# EAGLE design SparkX_EZ_ARTIC_R2 (EAGLE 9.6.2)
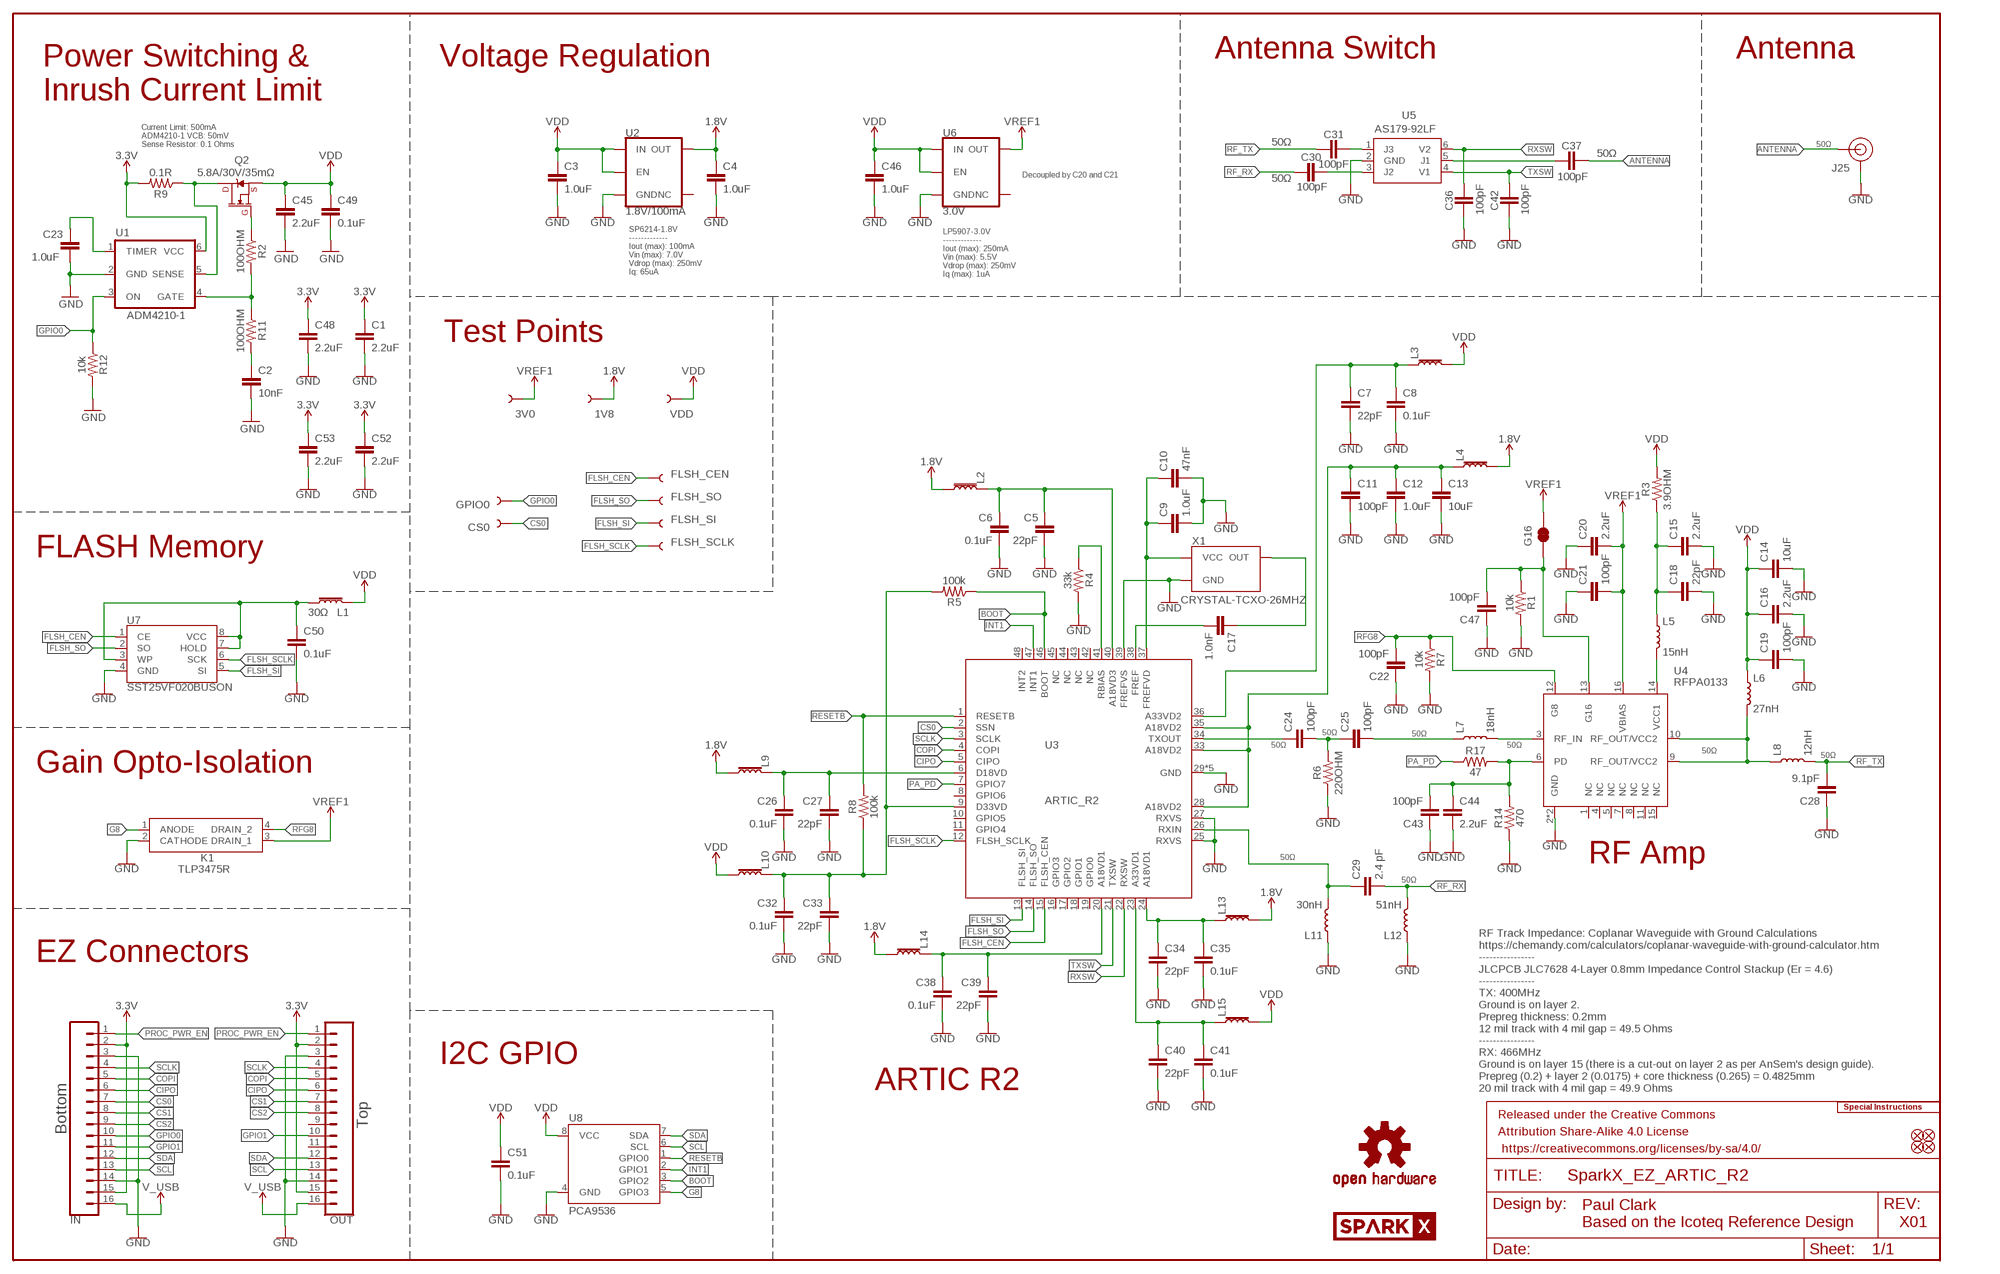
[diagram p0: schematic, sheet 1]

## Parts
1V8  TEST-POINT3  [PAD.03X.03]
3V0  TEST-POINT3  [PAD.03X.03]
C1  2.2uF  2.2UF-0402_TIGHT-10V-10%-X5R  [0402-TIGHT]
C2  10nF  10NF-0402T-25V-10%  [0402-TIGHT]
C3  1.0uF  1.0UF-0402T-16V-10%  [0402-TIGHT]
C4  1.0uF  1.0UF-0402T-16V-10%  [0402-TIGHT]
C5  22pF  22PF-0402T-16V-10%  [0402-TIGHT]
C6  0.1uF  0.1UF-0402T-6.3V-10%-X7R  [0402-TIGHT]
C7  22pF  22PF-0402T-16V-10%  [0402-TIGHT]
C8  0.1uF  0.1UF-0402T-6.3V-10%-X7R  [0402-TIGHT]
C9  1.0uF  1.0UF-0402T-16V-10%  [0402-TIGHT]
C10  47nF  47NF-0402_TIGHT-25V-10%-X7R  [0402-TIGHT]
C11  100pF  100PF-0402T-50V-5%  [0402-TIGHT]
C12  1.0uF  1.0UF-0402T-16V-10%  [0402-TIGHT]
C13  10uF  10UF-0402T-6.3V-20%  [0402-TIGHT]
C14  10uF  10UF-0402T-6.3V-20%  [0402-TIGHT]
C15  2.2uF  2.2UF-0402_TIGHT-10V-10%-X5R  [0402-TIGHT]
C16  2.2uF  2.2UF-0402_TIGHT-10V-10%-X5R  [0402-TIGHT]
C17  1.0nF  1.0NF/1000PF-0402_TIGHT-50V-10%  [0402-TIGHT]
C18  22pF  22PF-0402T-16V-10%  [0402-TIGHT]
C19  100pF  100PF-0402T-50V-5%  [0402-TIGHT]
C20  2.2uF  2.2UF-0402_TIGHT-10V-10%-X5R  [0402-TIGHT]
C21  100pF  100PF-0402T-50V-5%  [0402-TIGHT]
C22  100pF  100PF-0402T-50V-5%  [0402-TIGHT]
C23  1.0uF  1.0UF-0402T-16V-10%  [0402-TIGHT]
C24  100pF  100PF-0402T-50V-5%  [0402-TIGHT]
C25  100pF  100PF-0402T-50V-5%  [0402-TIGHT]
C26  0.1uF  0.1UF-0402T-6.3V-10%-X7R  [0402-TIGHT]
C27  22pF  22PF-0402T-16V-10%  [0402-TIGHT]
C28  9.1pF  9.1PF-0402-TIGHT  [0402-TIGHT]
C29  2.4 pF  2.4PF-0402  [0402_MURATA]
C30  100pF  100PF-0402T-50V-5%  [0402-TIGHT]
C31  100pF  100PF-0402T-50V-5%  [0402-TIGHT]
C32  0.1uF  0.1UF-0402T-6.3V-10%-X7R  [0402-TIGHT]
C33  22pF  22PF-0402T-16V-10%  [0402-TIGHT]
C34  22pF  22PF-0402T-16V-10%  [0402-TIGHT]
C35  0.1uF  0.1UF-0402T-6.3V-10%-X7R  [0402-TIGHT]
C36  100pF  100PF-0402T-50V-5%  [0402-TIGHT]
C37  100pF  100PF-0402T-50V-5%  [0402-TIGHT]
C38  0.1uF  0.1UF-0402T-6.3V-10%-X7R  [0402-TIGHT]
C39  22pF  22PF-0402T-16V-10%  [0402-TIGHT]
C40  22pF  22PF-0402T-16V-10%  [0402-TIGHT]
C41  0.1uF  0.1UF-0402T-6.3V-10%-X7R  [0402-TIGHT]
C42  100pF  100PF-0402T-50V-5%  [0402-TIGHT]
C43  100pF  100PF-0402T-50V-5%  [0402-TIGHT]
C44  2.2uF  2.2UF-0402_TIGHT-10V-10%-X5R  [0402-TIGHT]
C45  2.2uF  2.2UF-0402_TIGHT-10V-10%-X5R  [0402-TIGHT]
C46  1.0uF  1.0UF-0402T-16V-10%  [0402-TIGHT]
C47  100pF  100PF-0402T-50V-5%  [0402-TIGHT]
C48  2.2uF  2.2UF-0402_TIGHT-10V-10%-X5R  [0402-TIGHT]
C49  0.1uF  0.1UF-0402T-10V-10%-X7R  [0402-TIGHT]
C50  0.1uF  0.1UF-0402T-6.3V-10%-X7R  [0402-TIGHT]
C51  0.1uF  0.1UF-0402T-10V-10%-X7R  [0402-TIGHT]
C52  2.2uF  2.2UF-0402_TIGHT-10V-10%-X5R  [0402-TIGHT]
C53  2.2uF  2.2UF-0402_TIGHT-10V-10%-X5R  [0402-TIGHT]
CS0  TEST-POINT3  [PAD.03X.03]
FD1  FIDUCIALUFIDUCIAL  [FIDUCIAL-MICRO]
FD2  FIDUCIALUFIDUCIAL  [FIDUCIAL-MICRO]
FD3  FIDUCIALUFIDUCIAL  [FIDUCIAL-MICRO]
FD4  FIDUCIALUFIDUCIAL  [FIDUCIAL-MICRO]
FLSH_CEN  TEST-POINT3  [PAD.03X.03]
FLSH_SCLK  TEST-POINT3  [PAD.03X.03]
FLSH_SI  TEST-POINT3  [PAD.03X.03]
FLSH_SO  TEST-POINT3  [PAD.03X.03]
FRAME1  FRAME-LEDGER  [CREATIVE_COMMONS]
G16  JUMPER-SMT_2_NC_TRACE_NO-SILK  [SMT-JUMPER_2_NC_TRACE_NO-SILK]
GPIO0  TEST-POINT3  [PAD.03X.03]
IN  CONN_16FPC_16_0.5MM  [FPC_16_0.5MM]
J25  U.FL  U.FL2PIN_REDUCED_FOOTPRINT  [U.FL_REDUCED_FOOTPRINT]
K1  TLP3475R  [TLP3475RTPF]
L1  30Ω  FERRITE_BEAD-0402-30OHM-100MHZ  [0402-TIGHT]
L2  30Ω  FERRITE_BEAD-0402-30OHM-100MHZ  [0402-TIGHT]
L3  30Ω  FERRITE_BEAD-0402-30OHM-100MHZ  [0402-TIGHT]
L4  30Ω  FERRITE_BEAD-0402-30OHM-100MHZ  [0402-TIGHT]
L5  15nH  15NH-0402  [0402_COILCRAFT]
L6  27nH  27NH-0402  [0402_COILCRAFT]
L7  18nH  18NH-0402  [0402_COILCRAFT]
L8  12nH  12NH-0402  [0402_COILCRAFT]
L9  30Ω  FERRITE_BEAD-0402-30OHM-100MHZ  [0402-TIGHT]
L10  30Ω  FERRITE_BEAD-0402-30OHM-100MHZ  [0402-TIGHT]
L11  30nH  30NH-0402  [0402_COILCRAFT]
L12  51nH  51NH-0402  [0402_COILCRAFT]
L13  30Ω  FERRITE_BEAD-0402-30OHM-100MHZ  [0402-TIGHT]
L14  30Ω  FERRITE_BEAD-0402-30OHM-100MHZ  [0402-TIGHT]
L15  30Ω  FERRITE_BEAD-0402-30OHM-100MHZ  [0402-TIGHT]
LOGO1  SPECIAL_INSTRUCTIONS-ORDERING  [ORDERING_INSTRUCTIONS]
LOGO2  OSHW-LOGOMINI  [OSHW-LOGO-MINI]
LOGO3  OSHW-LOGOMINI  [OSHW-LOGO-MINI]
OUT  CONN_16FPC_16_0.5MM  [FPC_16_0.5MM]
Q2  5.8A/30V/35mΩ  MOSFET-NCH-AO3404A  [SOT23-3]
R1  10k  10KOHM-0402T-1/16W-1%  [0402-TIGHT]
R2  100OHM  [0402-TIGHT]
R3  3.9OHM  [0402-TIGHT]
R4  33k  33KOHM-0402T-1/16W-1%  [0402-TIGHT]
R5  100k  100KOHM-0402T-1/16W-1%  [0402-TIGHT]
R6  220OHM  [0402-TIGHT]
R7  10k  10KOHM-0402T-1/16W-1%  [0402-TIGHT]
R8  100k  100KOHM-0402T-1/16W-1%  [0402-TIGHT]
R9  0.1R  RESISTOR_0603_100MILLIOHM0603  [0603]
R11  100OHM  [0402-TIGHT]
R12  10k  10KOHM-0402T-1/16W-1%  [0402-TIGHT]
R14  470  470OHM-0402-TIGHT-1/16W-1%  [0402-TIGHT]
R17  47  47OHM-0402-TIGHT-1/16W-1%  [0402-TIGHT]
U1  ADM4210-1  [TSOT6]
U2  1.8V/100mA  V_REG_SP6214-1.8V  [SC70]
U3  ARTIC_R2  [QFN-48]
U4  RFPA0133  [QFN50P300X300X86-17N]
U5  AS179-92LF  [SOT65P220X100-6N]
U6  3.0V  V_REG_LP5907SOT23-3.0V  [SOT23-5]
U7  SST25VF020BUSON  [USON_3X2MM]
U8  PCA9536  [MSOP8]
U$4  SPARKX-LOGO3  [SPARKX-SMALL]
U$8  SPARKX-LOGO2  [SPARKX-TINY]
VDD  TEST-POINT3  [PAD.03X.03]
X1  CRYSTAL-TCXO-26MHZ  [CRYSTAL-TCXO-SMD-1.65X1.25]

## Nets
1.8V: 1V8.1 C4.1 L2.2 L4.2 L9.2 L13.2 L14.2 U2.5(OUT)
3.3V: C1.1 C48.1 C52.1 C53.1 IN.2 IN.15 OUT.2 OUT.15 R9.2 U1.6(VCC)
ANTENNA: C37.1 J25.FEED(SIGNAL)
BOOT: R5.1 U3.46(BOOT) U8.3(GPIO2)
CIPO: IN.6 OUT.6 U3.5(CIPO)
COPI: IN.5 OUT.5 U3.4(COPI)
CS0: CS0.1 IN.7 U3.2(SSN)
CS1: IN.8 OUT.7
CS2: IN.9 OUT.8
FLASH_VCC: C50.1 L1.1 U7.3(WP) U7.7(HOLD) U7.8(VCC)
FLSH_CEN: FLSH_CEN.1 U3.15(FLSH_CEN) U7.1(CE)
FLSH_SCLK: FLSH_SCLK.1 U3.12(FLSH_SCLK) U7.6(SCK)
FLSH_SI: FLSH_SI.1 U3.13(FLSH_SI) U7.5(SI)
FLSH_SO: FLSH_SO.1 U3.14(FLSH_SO) U7.2(SO)
G8: K1.1(ANODE) U8.5(GPIO3)
GND: C1.2 C2.2 C3.2 C4.2 C5.2 C6.2 C7.2 C8.2 C9.2 C10.2 C11.2 C12.2 C13.2 C14.2 C15.2 C16.2 C18.2 C19.2 C20.1 C21.1 C22.1 C23.2 C26.2 C27.2 C28.1 C32.2 C33.2 C34.2 C35.2 C36.2 C38.2 C39.2 C40.2 C41.2 C42.2 C43.1 C44.2 C45.2 C46.2 C47.1 C48.2 C49.2 C50.2 C51.2 C52.2 C53.2 IN.3 IN.14 J25.1(GND) J25.2(GND) K1.2(CATHODE) L11.P$1 L12.P$1 OUT.3 OUT.14 R1.2 R4.2 R6.1 R7.2 R12.2 R14.1 U1.2(GND) U2.2(GND) U3.25(RXVS) U3.27(RXVS) U3.29(GND) U3.30(GND) U3.31(GND) U3.32(GND) U3.39(FREFVS) U3.GND U4.2(GND) U4.EDAP(GND) U5.2(GND) U6.2(GND) U7.4(GND) U8.4(GND) X1.1(GND) X1.2(GND)
GPIO0: GPIO0.1 IN.10 R12.1 U1.3(ON)
GPIO1: IN.11 OUT.10
INT1: U3.47(INT1) U8.2(GPIO1)
N$1: Q2.3(D) R9.1 U1.5(SENSE)
N$2: Q2.1(G) R2.1
N$3: R2.2 R11.1 U1.4(GATE)
N$4: C34.1 C35.1 L13.1 U3.24(A18VD1)
N$5: C40.1 C41.1 L15.1 U3.23(A33VD1)
N$6: C2.1 R11.2
N$7: C23.1 U1.1(TIMER)
N$8: C26.1 C27.1 L9.1 U3.6(D18VD)
N$9: C32.1 C33.1 L10.1 R5.2 R8.1 U3.9(D33VD)
N$10: C11.1 C12.1 C13.1 L4.1 U3.28(A18VD2) U3.33(A18VD2) U3.35(A18VD2)
N$11: C7.1 C8.1 L3.1 U3.36(A33VD2)
N$12: R4.1 U3.41(RBIAS)
N$13: C5.1 C6.1 L2.1 U3.40(A18VD3)
N$14: C9.1 C10.1 U3.37(FREFVD) X1.4(VCC)
N$15: C17.1 X1.3(OUT)
N$16: C17.2 U3.38(FREF)
N$17: C24.1 U3.34(TXOUT)
N$18: C24.2 C25.1 R6.2
N$19: L5.P$2 U4.14(VCC1)
N$20: C15.1 C18.1 L5.P$1 R3.1
N$21: C29.P$1 L11.P$2 U3.26(RXIN)
N$24: C25.2 L7.P$1
N$25: L7.P$2 U4.3(RF_IN)
N$26: L6.P$2 L8.P$1 U4.9(RF_OUT/VCC2) U4.10(RF_OUT/VCC2)
N$28: C31.1 U5.1(J3)
N$29: C30.1 U5.3(J2)
N$30: C37.2 U5.5(J1)
N$31: C38.1 C39.1 L14.1 U3.20(A18VD1)
PA_PD: R17.1 U3.7(GPIO7)
PD: C43.2 C44.1 R14.2 R17.2 U4.6(PD)
PROC_PWR_EN: IN.1 OUT.1
RESETB: R8.2 U3.1(RESETB) U8.1(GPIO0)
RF_RX: C29.P$2 C30.2 L12.P$2
RF_TX: C28.2 C31.2 L8.P$2
RFG8: C22.2 K1.4(DRAIN_2) R7.1 U4.12(G8)
RFG16: C47.2 G16.1 R1.1 U4.13(G16)
RXSW: C36.1 U3.22(RXSW) U5.6(V2)
SCL: IN.13 OUT.13 U8.6(SCL)
SCLK: IN.4 OUT.4 U3.3(SCLK)
SDA: IN.12 OUT.12 U8.7(SDA)
TXSW: C42.1 U3.21(TXSW) U5.4(V1)
V_USB: IN.16 OUT.16
VDD: C3.1 C14.1 C16.1 C19.1 C45.1 C46.1 C49.1 C51.1 L1.2 L3.2 L6.P$1 L10.2 L15.2 Q2.2(S) R3.2 U2.1(IN) U2.3(EN) U6.1(IN) U6.3(EN) U8.8(VCC) VDD.1
VREF1: 3V0.1 C20.2 C21.2 G16.2 K1.3(DRAIN_1) U4.16(VBIAS) U6.5(OUT)
Unconnected: OUT.9 OUT.11 U2.4(NC) U3.8(GPIO6) U3.10(GPIO5) U3.11(GPIO4) U3.16(GPIO3) U3.17(GPIO2) U3.18(GPIO1) U3.19(GPIO0) U3.42(NC) U3.43(NC) U3.44(NC) U3.45(NC) U3.48(INT2) U4.1(NC) U4.4(NC) U4.5(NC) U4.7(NC) U4.8(NC) U4.11(NC) U4.15(NC) U6.4(NC)

## Notes on the sheet
- Voltage Regulation | Antenna Switch | Antenna
- Power Switching &
  Inrush Current Limit
- Current Limit: 500mA
  ADM4210-1 VCB: 50mV
  Sense Resistor: 0.1 Ohms
- 50Ω | 50Ω
- 50Ω
- Decoupled by C20 and C21
- 50Ω
- SP6214-1.8V
  -------------
  Iout (max): 100mA 
  Vin (max): 7.0V
  Vdrop (max): 250mV
  Iq: 65uA
- LP5907-3.0V
  -------------
  Iout (max): 250mA 
  Vin (max): 5.5V
  Vdrop (max): 250mV
  Iq (max): 1uA
- Test Points
- FLASH Memory
- 50Ω | 50Ω
- 50Ω | 50Ω
- 50Ω
- 50Ω
- Gain Opto-Isolation
- 50Ω
- RF Amp
- 50Ω
- RF Track Impedance: Coplanar Waveguide with Ground Calculations
  https://chemandy.com/calculators/coplanar-waveguide-with-ground-calculator.htm
  ----------------
  JLCPCB JLC7628 4-Layer 0.8mm Impedance Control Stackup (Er = 4.6)
  ----------------
  TX: 400MHz
  Ground is on layer 2.
  Prepreg thickness: 0.2mm
  12 mil track with 4 mil gap = 49.5 Ohms
  ----------------
  RX: 466MHz
  Ground is on layer 15 (there is a cut-out on layer 2 as per AnSem's design guide).
  Prepreg (0.2) + layer 2 (0.0175) + core thickness (0.265) = 0.4825mm
  20 mil track with 4 mil gap = 49.9 Ohms
- EZ Connectors
- I2C GPIO
- ARTIC R2
- Top
- Bottom
- Paul Clark
  Based on the Icoteq Reference Design
- X01

## Library data of the parts
1V8 3V0 CS0 FLSH_CEN FLSH_SCLK FLSH_SI FLSH_SO GPIO0 VDD = SparkFun-Connectors:TEST-POINT: SparkFun Test Points Bare copper test points for troubleshooting or In-Circuit-Testing. These are used by our Production team for verifying production board runs using pogo-pins on test beds. SparkFun Products: SparkFun LSM9DS1 Breakout <https://www.sparkfun.com/products/13284> SparkFun PSOC <https://www.sparkfun.com/products/13714> SparkFun Load Cell Amplifier <https://www.sparkfun.com/products/13879>
C1 C15 C16 C20 C44 C45 C48 C52 C53 = SparkFun-Capacitors:2.2UF: 2.2µF ceramic capacitors A capacitor is a passive two-terminal electrical component used to store electrical energy temporarily in an electric field.; PROD_ID: CAP-14232
C2 = SparkFun-Capacitors:10NF: 0.01uF/10nF/10,000pF ceramic capacitors A capacitor is a passive two-terminal electrical component used to store electrical energy temporarily in an electric field. CAP-09321; PROD_ID: CAP-14847
C3 C4 C9 C12 C23 C46 = SparkFun-Capacitors:1.0UF: 1µF ceramic capacitors A capacitor is a passive two-terminal electrical component used to store electrical energy temporarily in an electric field.; PROD_ID: CAP-12417
C5 C7 C18 C27 C33 C34 C39 C40 = SparkFun-Capacitors:22PF: 22pF ceramic capacitors A capacitor is a passive two-terminal electrical component used to store electrical energy temporarily in an electric field.; PROD_ID: CAP-14674
C6 C8 C26 C32 C35 C38 C41 C50 = SparkFun-Capacitors:0.1UF: 0.1µF ceramic capacitors A capacitor is a passive two-terminal electrical component used to store electrical energy temporarily in an electric field.; PROD_ID: CAP-14993
C10 = SparkFun-Capacitors:47NF: 47nF ceramic capacitors A capacitor is a passive two-terminal electrical component used to store electrical energy temporarily in an electric field.; PROD_ID: CAP-14243
C11 C19 C21 C22 C24 C25 C30 C31 C36 C37 C42 C43 C47 = SparkFun-Capacitors:100PF: 100pF/0.1nF ceramic capacitors A capacitor is a passive two-terminal electrical component used to store electrical energy temporarily in an electric field.; PROD_ID: CAP-13458
C13 C14 = SparkFun-Capacitors:10UF: 10.0µF ceramic capacitors A capacitor is a passive two-terminal electrical component used to store electrical energy temporarily in an electric field.; PROD_ID: CAP-14848
C17 = SparkFun-Capacitors:1.0NF/1000PF: 1nF/1,000pF ceramic capacitors A capacitor is a passive two-terminal electrical component used to store electrical energy temporarily in an electric field.; PROD_ID: CAP-14280
C28 = New_Parts_Capacitors:9.1PF: 9.1pF ceramic capacitors A capacitor is a passive two-terminal electrical component used to store electrical energy temporarily in an electric field.; MOUSER_PART: 609-500R07S9R1CV4T; PROD_ID: CAP-15278
C29 = SparkFun-Capacitors:2.4PF; PROD_ID: CAP-14351
C49 C51 = SparkFun-Capacitors:0.1UF: 0.1µF ceramic capacitors A capacitor is a passive two-terminal electrical component used to store electrical energy temporarily in an electric field.; PROD_ID: CAP-15083
FD1-FD4 = SparkFun-Aesthetics:FIDUCIAL: Fiducial Alignment Points Point-of-reference for pick-and-place machines and other optical instruments.
FRAME1 = SparkFun-Aesthetics:FRAME-LEDGER: Schematic Frame - Ledger Standard 11x14 US Ledger frame
G16 = SparkFun-Jumpers:JUMPER-SMT_2_NC_TRACE: Normally closed trace jumper This jumper has a trace between two pads so it's normally closed (NC). Use a razor knife to open the connection. For best results follow the IPC guidelines for cutting traces: Cutout at least 0.063 mm (0.005 in). Remove all loose material to clean up the cut area. Seal the cut with an approved epoxy. Reapply solder to reclose the connection.
IN OUT = SparkFun-Connectors:CONN_16: Multi connection point. Often used as Generic Header-pin footprint for 0.1 inch spaced/style header connections On any of the 0.1 inch spaced packages, you can populate with these: Break Away Headers - Straight <https://www.sparkfun.com/products/116> (PRT-00116) Break Away Male Headers - Right Angle <https://www.sparkfun.com/products/553> (PRT-00553) Female Headers <https://www.sparkfun.com/products/115> (PRT-00115) Break Away Headers - Machine Pin <https://www.sparkfun.com/products/117> (PRT-00117) Break Away Female Headers - Swiss Machine Pin <https://www.sparkfun.com/products/743> (PRT-00743) For SCREWTERMINALS and SPRING TERMINALS visit here: Screw Terimnals on SparkFun.com <https://www.sparkfun.com/search/results?term=Screw+Terminals> (5mm/3.5mm/2.54mm spacing) This device is also useful as a general connection point to wire up your design to another part of your project. Our various solder wires solder well into these plated through hole pads. Hook-Up Wire - Assortment (Stranded, 22 AWG) <https://www.sparkfun.com/products/11375> (PRT-11375) Hook-Up Wire - Assortment (Solid Core, 22 AWG) <https://www.sparkfun.com/products/11367> (PRT-11367) View the entire wire category on our website here <https://www.sparkfun.com/categories/141> Special notes: Molex polarized connector foot print use with SKU : PRT-08231 with associated crimp pins and housings. 1MM SMD Version SKU: PRT-10208 NOTES ON THE VARIANTS LOCK and LOCK_LONGPADS... This footprint was designed to help hold the alignment of a through-hole component (i.e. 6-pin header) while soldering it into place. You may notice that each hole has been shifted either up or down by 0.005 of an inch from it's more standard position (which is a perfectly straight line). This slight alteration caused the pins (the squares in the middle) to touch the edges of the holes. Because they are alternating, it causes a "brace" to hold the component in place. 0.005 has proven to be the perfect amount of "off-center" position when using our standard breakaway headers. Although looks a little odd when you look at the bare footprint, once you have a header in there, the alteration is very hard to notice. Also,if you push a header all the way into place, it is covered up entirely on the bottom side.; PROD_ID: CONN-16066
J25 = New_Parts_Connectors:U.FL2PIN: SMD Antenna Connector - U.FL 2mm height, 3.0mm x 3.0mm receptacle size. SparkFun Products: SparkFun WiFi Shield - ESP8266 <https://www.sparkfun.com/products/13287> SparkFun ESP8266 Thing <https://www.sparkfun.com/products/13231> SparkFun MiniGen - Pro Mini Signal Generator Shield <https://www.sparkfun.com/products/11420>
K1 = New_Parts_DiscreteSemi:TLP3475R: Solid State Relays - PCB Mount Photo-IC 3mA 50V 5000Vrms Source: Datasheet <http://toshiba.semicon-storage.com/info/docget.jsp?did=55304&prodName=TLP3475R>; DESCRIPTION: Solid State Relays - PCB Mount Photo-IC 3mA 50V 5000Vrms; DIGIKEY_PART: TLP3475R(TPFCT-ND - Cut Tape (CT); MANUFACTURER_NAME: Toshiba; MANUFACTURER_PART_NUMBER: TLP3475R; MOUSER_PART_NUMBER: 757-TLP3475RTPF; MOUSER_PRICE-STOCK: https://www.mouser.com/Search/Refine.aspx?Keyword=757-TLP3475RTPF; PROD_ID: IC-15447
L1-L4 L9 L10 L13-L15 = SparkFun-Coils:FERRITE_BEAD: Ferrite Bead (blocks, cores, rings, chokes, etc.) Inductor with layers of ferrite used to suppress high frequencies. Often used to isolate high frequency noise. SparkFun Products: IOIO-OTG - V2.2 <https://www.sparkfun.com/products/13613> SparkFun SAMD21 Mini Breakout <https://www.sparkfun.com/products/13664> SparkFun 6 Degrees of Freedom Breakout - LSM6DS3 <https://www.sparkfun.com/products/13339> SparkFun SAMD21 Dev Breakout <https://www.sparkfun.com/products/13672>; PROD_ID: NDUC-15133
L5 = SparkFun-Coils:15NH; MOUSER_PART: 994-0402HP-15NXGLU; PROD_ID: NDUC-15272
L6 = SparkFun-Coils:27NH; MOUSER_PART: 994-0402HP-27NXGLU; PROD_ID: NDUC-15273
L7 = SparkFun-Coils:18NH; MOUSER_PART: 994-0402HP-18NXGLU; PROD_ID: NDUC-15277
L8 = SparkFun-Coils:12NH; MOUSER_PART: 994-0402HP-12NXGLU; PROD_ID: NDUC-15271
L11 = SparkFun-Coils:30NH; MOUSER_PART: 994-0402HP-30NXGLU; PROD_ID: NDUC-15275
L12 = SparkFun-Coils:51NH; MOUSER_PART: 994-0402HP-51NXGLU; PROD_ID: NDUC-15276
LOGO1 = SparkFun-Aesthetics:SPECIAL_INSTRUCTIONS: Special Ordering/Production Instructions Alert Symbol for special PCB ordering instructions or unique production process warnings. Ordering Instructions Production Instructions Types of information that should be added to box: Copper weight Soldermask color Silk color PCB thickness Number of layers PCB Standard: 1.6mm FR4 1 oz copper immersion silver plating red soldermask white silkscreen Types of information that should be added to box: Special wash requirements Depaneling instructions Humidification Glue curing Default text settings: 0.07 inch 9% ratio 50% line distance
LOGO2 LOGO3 = SparkFun-Aesthetics:OSHW-LOGO: Open-Source Hardware (OSHW) Logo This logo indicates the piece of hardware it is found on incorporates a OSHW license and/or adheres to the definition of open source hardware found here: http://freedomdefined.org/OSHW
Q2 = SparkFun-DiscreteSemi:MOSFET-NCH: N-channel MOSFETs Voltage controlled devices that allow control of high current outputs. SparkFun Products: SparkFun OpenScale <https://www.sparkfun.com/products/13261> SparkFun Digital Sandbox <https://www.sparkfun.com/products/12651> SparkFun Monster Moto Shield <https://www.sparkfun.com/products/10182> SparkFun MOSFET Power Controller <https://www.sparkfun.com/products/11214>; PROD_ID: TRANS-12988
R1 R7 R12 = SparkFun-Resistors:10KOHM: 10kΩ resistor A resistor is a passive two-terminal electrical component that implements electrical resistance as a circuit element. Resistors act to reduce current flow, and, at the same time, act to lower voltage levels within circuits. - Wikipedia; PROD_ID: RES-14241
R2 R11 = New_Parts_Resistors:100OHM: 100Ω resistor A resistor is a passive two-terminal electrical component that implements electrical resistance as a circuit element. Resistors act to reduce current flow, and, at the same time, act to lower voltage levels within circuits. - Wikipedia; PROD_ID: RES-14962
R3 = New_Parts_Resistors:3.9OHM: 3.9Ω resistor A resistor is a passive two-terminal electrical component that implements electrical resistance as a circuit element. Resistors act to reduce current flow, and, at the same time, act to lower voltage levels within circuits. - Wikipedia; MOUSER_PART: 603-RC0402FR-073R9L; PROD_ID: RES-15270
R4 = SparkFun-Resistors:33KOHM: 33kΩ resistor A resistor is a passive two-terminal electrical component that implements electrical resistance as a circuit element. Resistors act to reduce current flow, and, at the same time, act to lower voltage levels within circuits. - Wikipedia; PROD_ID: RES-15128
R5 R8 = SparkFun-Resistors:100KOHM: 100kΩ resistor A resistor is a passive two-terminal electrical component that implements electrical resistance as a circuit element. Resistors act to reduce current flow, and, at the same time, act to lower voltage levels within circuits. - Wikipedia; PROD_ID: RES-13495
R6 = New_Parts_Resistors:220OHM: 220Ω resistor A resistor is a passive two-terminal electrical component that implements electrical resistance as a circuit element. Resistors act to reduce current flow, and, at the same time, act to lower voltage levels within circuits. - Wikipedia; MOUSER_PART: 755-SFR01MZPF2200; PROD_ID: RES-15269
R9 = New_Parts_Resistors:RESISTOR_0603_100MILLIOHM: Generic Resistor Package; DIGIKEY_PART: P17478CT-ND; MANUFACTURER_PART: ERJ-3BWFR100V; PROD_ID: RES-15715
R14 = New_Parts_Resistors:470OHM: 470Ω resistor A resistor is a passive two-terminal electrical component that implements electrical resistance as a circuit element. Resistors act to reduce current flow, and, at the same time, act to lower voltage levels within circuits. - Wikipedia; PROD_ID: RES-15584
R17 = New_Parts_Resistors:47OHM: 47Ω resistor A resistor is a passive two-terminal electrical component that implements electrical resistance as a circuit element. Resistors act to reduce current flow, and, at the same time, act to lower voltage levels within circuits. - Wikipedia; PROD_ID: RES-15585
U1 = New_Parts_IC-Power:ADM4210: Hot Swap Controller (In-Rush Current Limiter); PROD_ID: IC-14694
U2 = SparkFun-IC-Power:V_REG_SP6214: Voltage Regulator - SP6214 SP6214 Series SC-70-5 Micropower SC-70 100 mA CMOS LDO Regulator Datasheet <https://www.exar.com/content/document.ashx?id=654> SparkFun Products: MP3 Trigger <https://www.sparkfun.com/products/13720> SparkFun Particle Sensor Breakout <https://www.sparkfun.com/products/14045>; PROD_ID: VREG-08428
U3 = New_Parts_IC-Comms:ARTIC_R2: AnSem ARTIC R2 Chipset The ARTIC is an integrated low power small size ARGOS 2/3/4 single chip radio. ARTIC implements a message based wireless interface. For satellite uplink communication, ARTIC will encode, modulate and transmit provided user messages. For downlink communication, ARTIC will lock to the downstream, demodulate and decode and extract the satellite messages. The ARTIC can transmit signals in frequency bands around 400MHz and receive signals in the bands around 466MHz, in accordance with the ARGOS satellite system specifications. The ARTIC is compliant and certified for all ARGOS 2 and ARGOS 3 TX standards. It contains a RF transceiver, afrequency synthesizer and a digital baseband modem. The ARTIC contains an on-chip power amplifier delivering 1mW [0dBm] output power, that serves as an output for connecting an external high efficient PA. The (de)modulation algorithms run on an on-chip DSP. This software approach allows for retargeting the ARTIC for other applications. The DSP program can be retained on an external flash or the MCU.; PROD_ID: IC-15312
U4 = New_Parts_IC-Comms:RFPA0133: IC PROG PWR AMP 16-QFN Source: Datasheet <http://www.qorvo.com/products/d/da000936>; MANUFACTURER_NAME: Qorvo; MANUFACTURER_PART_NUMBER: RFPA0133TR7; MOUSER_PART_NUMBER: 772-RFPA0133; PROD_ID: IC-15274
U5 = New_Parts_IC-Comms:AS179-92LF: SKYWORKS SOLUTIONS - AS179-92LF - IC, SWITCH, RF, SPDT, 0.02-3.0GHZ Source: Datasheet <http://www.skyworksinc.com/uploads/documents/AS179_92LF_200176H.pdf>; PROD_ID: IC-15047
U6 = New_Parts_IC-Power:V_REG_LP5907: LP5907 - 250mA Ultra-Low-Noise LDO Regulator w/ Enable The LP5907 is a low-noise LDO that can supply up to 250 mA output current. Designed to meet the requirements of RF and analog circuits, the LP5907 device provides low noise, high PSRR, low quiescent current, and low line or load transient response figures. Using new innovative design techniques, the LP5907 offers class-leading noise performance without a noise bypass capacitor and the ability for remote output capacitor placement. The device is designed to work with a 1-µF input and a 1-µF output ceramic capacitor (no separate noise bypass capacitor is required). This device is available with fixed output voltages from 1.2 V to 4.5 V in 25-mV steps.; DIGIKEY_PART: 296-40357-1-ND; MANU_PART: LP5907MFX-3.0/NOPB; MOUSER_PART: 595-LP5907MFX-3.0NPB; PACKAGE: SOT-23(5); PROD_ID: VREG-15586
U7 = New_Parts_IC-Memory:SST25VF020B: 2Mbit Serial Flash Memory 8pin SPI Flash Datasheet <http://ww1.microchip.com/downloads/en/DeviceDoc/20005054D.pdf>; DIGIKEY_PART: SST25VF020B-80-4I-Q3AE-TCT-ND; MANU_PART: SST25VF020B-80-4I-Q3AE-T; PROD_ID: IC-15716
U8 = SparkFun-IC-Conversion:PCA9536: PCA9536 4-Bit I2C I/O Expander; PROD_ID: IC-15034
U$4 U$8 = SparkX:SPARKX-LOGO
X1 = New_Parts_Clocks:CRYSTAL-TCXO-26MHZ: 26MHz Crystal Oscillator IQXT-350 LFTCXO073004CUTT Datasheet <https://www.mouser.co.uk/datasheet/2/741/iqxt-350-1-33-1075257.pdf> Frequency: 26MHz Frequency Stability: ±0.50ppm Frequency Tolerance: ±1.50ppm; MOUSER_PART: 449-LFTCXO073004CUTT; PROD_ID: XTAL-15279

## Net classes
1 Power: width 0.305 mm

## Board
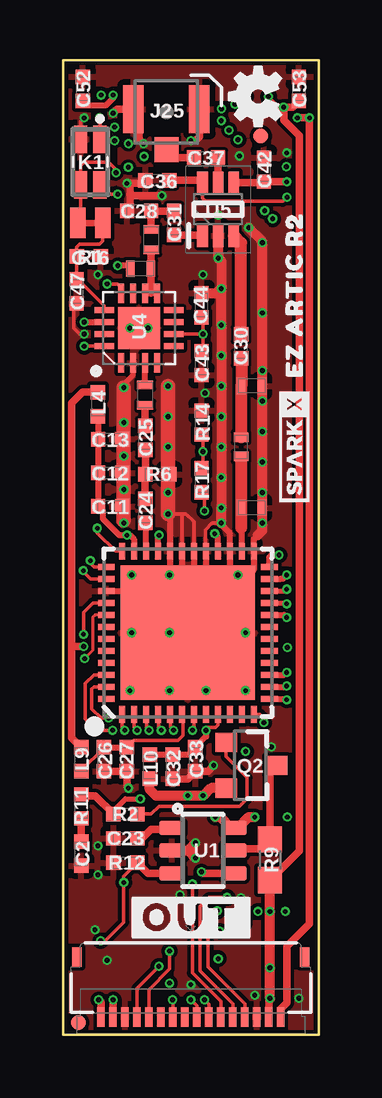
[diagram p1: board, top side]
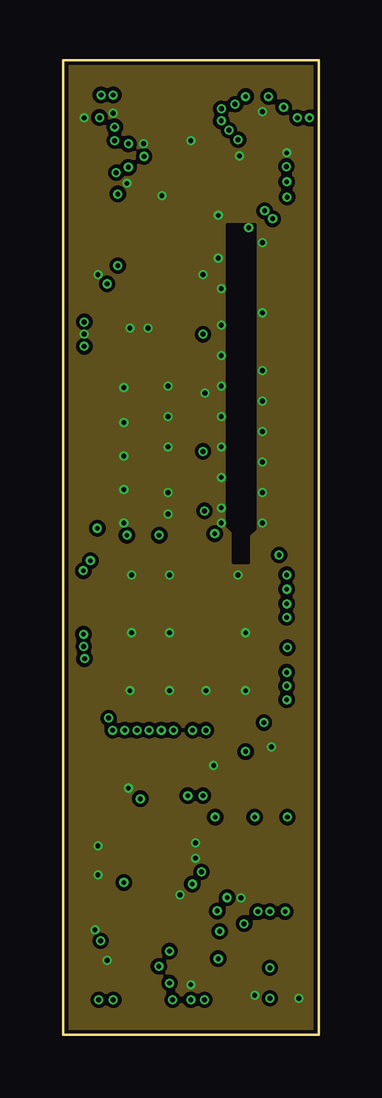
[diagram p2: board, inner layer Route2]
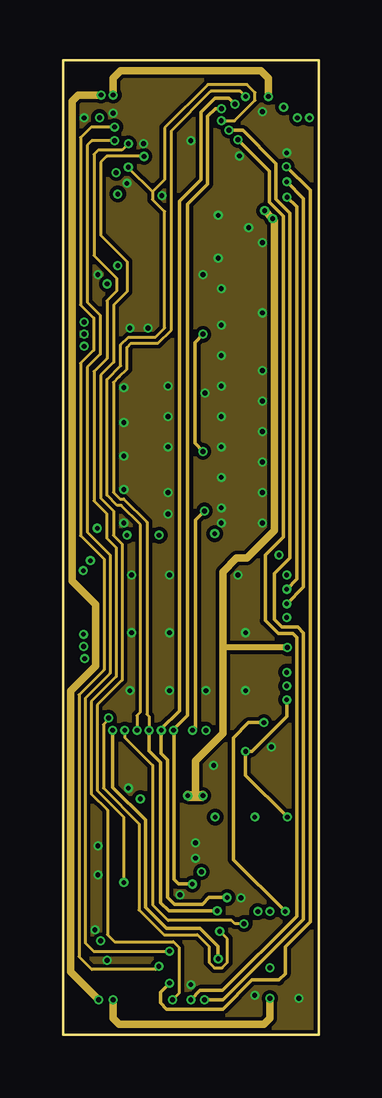
[diagram p3: board, inner layer Route15]
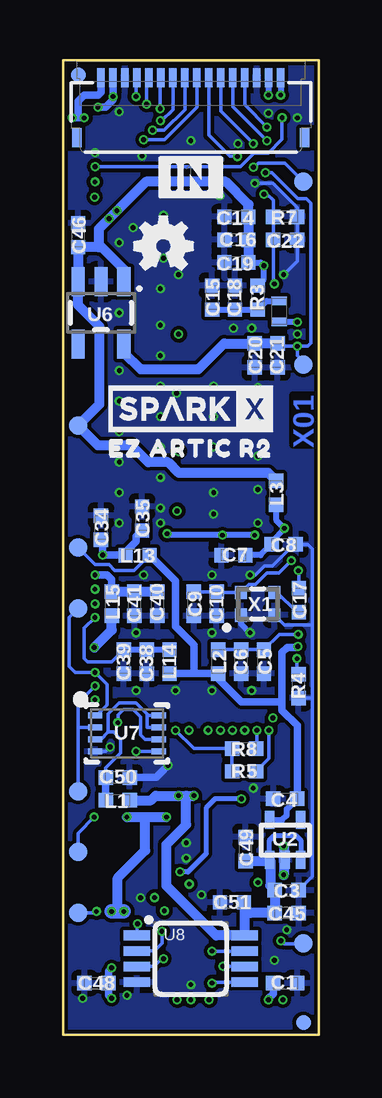
[diagram p4: board, bottom side, seen from below]

Size 10.67 x 40.64 mm. Coordinates in mm from the lower left corner, seen from the top.
Outline: 0,40.64 0,0 10.67,0 10.67,40.64 0,40.64
Copper layers (1+2*15+16): Top 0.035mm / dielectric 0.2mm / Route2 0.0175mm / dielectric 0.265mm / Route15 0.0175mm / dielectric 0.2mm / Bottom 0.035mm
Design rules "SparkFun-4_layer-Impedance_Control-JLCPCB-JLC7628": minimum track width 5mil, minimum drill 0.2mm, track to track 5mil, track to pad 5mil, pad to pad 5mil, via to via 5mil, smd to smd 0mil, copper to edge 5mil, drill to drill 5mil, minimum pad ring 3.5mil, minimum via ring 3.5mil, stop-mask expansion 2.5mil, vias tented up to drill 25mil, thermal gap 10mil
tRestrict: 3 lines

### Footprints (pad centres in the part's own frame; a part is rotated, then mirrored left to right if it is on the bottom)
PAD.03X.03 = smd 0.762 x 0.762: 1 0,0
0402-TIGHT = smd 0.6 x 0.6: 1 -0.5,0; 2 0.5,0
0402_MURATA = smd 0.4 x 0.6: P$1 -0.4,0; P$2 0.4,0
FIDUCIAL-MICRO = smd 0.635 x 0.635: 1 0,0
SMT-JUMPER_2_NC_TRACE_NO-SILK = smd 0.66 x 1.27: 1 -0.521,0; 2 0.521,0
FPC_16_0.5MM = smd 0.3 x 0.8: 1 -3.75,1.35; 2 -3.25,1.35; 3 -2.75,1.35; 4 -2.25,1.35; 5 -1.75,1.35; 6 -1.25,1.35; 7 -0.75,1.35; 8 -0.25,1.35; 9 0.25,1.35; 10 0.75,1.35; 11 1.25,1.35; 12 1.75,1.35; 13 2.25,1.35; 14 2.75,1.35; 15 3.25,1.35; 16 3.75,1.35 | smd 0.4 x 0.8: MP1 -4.75,-1.15; MP2 4.75,-1.15
U.FL_REDUCED_FOOTPRINT = smd 2 x 0.85: 1 -0.1,1.375; 2 -0.1,-1.375 | smd 1.05 x 1: FEED 1.575,0
TLP3475RTPF = smd 1.15 x 0.55: 1 -0.95,0.4; 2 -0.95,-0.4; 3 0.95,-0.4; 4 0.95,0.4
0402_COILCRAFT = smd 0.356 x 0.66: P$1 -0.432,0; P$2 0.432,0
SOT23-3 = smd 0.8 x 0.9: 1 -0.95,-1; 2 0.95,-1; 3 0,1.1
0603 = smd 1.1 x 1: 1 -0.85,0; 2 0.85,0
TSOT6 = smd 0.6 x 1.05: 1 -0.95,-1.3; 2 0,-1.3; 3 0.95,-1.3; 4 0.95,1.3; 5 0,1.3; 6 -0.95,1.3
SC70 = smd 0.4 x 0.75: 1 -0.65,-0.825; 2 0,-0.825; 3 0.65,-0.825; 4 0.65,0.825; 5 -0.65,0.825
QFN-48 = smd 0.7 x 0.25: 1 -3.4,2.75; 2 -3.4,2.25; 3 -3.4,1.75; 4 -3.4,1.25; 5 -3.4,0.75; 6 -3.4,0.25; 7 -3.4,-0.25; 8 -3.4,-0.75; 9 -3.4,-1.25; 10 -3.4,-1.75; 11 -3.4,-2.25; 12 -3.4,-2.75; 25 3.4,-2.75; 26 3.4,-2.25; 27 3.4,-1.75; 28 3.4,-1.25; 29 3.4,-0.75; 30 3.4,-0.25; 31 3.4,0.25; 32 3.4,0.75; 33 3.4,1.25; 34 3.4,1.75; 35 3.4,2.25; 36 3.4,2.75 | smd 0.25 x 0.7: 13 -2.75,-3.4; 14 -2.25,-3.4; 15 -1.75,-3.4; 16 -1.25,-3.4; 17 -0.75,-3.4; 18 -0.25,-3.4; 19 0.25,-3.4; 20 0.75,-3.4; 21 1.25,-3.4; 22 1.75,-3.4; 23 2.25,-3.4; 24 2.75,-3.4; 37 2.75,3.4; 38 2.25,3.4; 39 1.75,3.4; 40 1.25,3.4; 41 0.75,3.4; 42 0.25,3.4; 43 -0.25,3.4; 44 -0.75,3.4; 45 -1.25,3.4; 46 -1.75,3.4; 47 -2.25,3.4; 48 -2.75,3.4 | smd 5.6 x 5.6: GND 0,0
QFN50P300X300X86-17N = smd 0.8 x 0.25: 1 -1.45,0.75; 2 -1.45,0.25; 3 -1.45,-0.25; 4 -1.45,-0.75; 9 1.45,-0.75; 10 1.45,-0.25; 11 1.45,0.25; 12 1.45,0.75 | smd 0.25 x 0.8: 5 -0.75,-1.45; 6 -0.25,-1.45; 7 0.25,-1.45; 8 0.75,-1.45; 13 0.75,1.45; 14 0.25,1.45; 15 -0.25,1.45; 16 -0.75,1.45 | smd 1.75 x 1.75: EDAP 0,0
SOT65P220X100-6N = smd 0.95 x 0.45: 1 -1.1,0.65; 2 -1.1,0; 3 -1.1,-0.65; 4 1.1,-0.65; 5 1.1,0; 6 1.1,0.65
SOT23-5 = smd 0.55 x 1.2: 1 -0.95,-1.3; 2 0,-1.3; 3 0.95,-1.3; 4 0.95,1.3; 5 -0.95,1.3
USON_3X2MM = smd 0.6 x 0.25: 1 -1.325,0.75; 2 -1.325,0.25; 3 -1.325,-0.25; 4 -1.325,-0.75; 5 1.325,-0.75; 6 1.325,-0.25; 7 1.325,0.25; 8 1.325,0.75
MSOP8 = smd 1.1 x 0.4: 1 -2.25,0.975; 2 -2.25,0.325; 3 -2.25,-0.325; 4 -2.25,-0.975; 5 2.25,-0.975; 6 2.25,-0.325; 7 2.25,0.325; 8 2.25,0.975
CRYSTAL-TCXO-SMD-1.65X1.25 = smd 0.5 x 0.55: 1 -0.7,-0.475; 2 0.7,-0.475; 3 0.7,0.475; 4 -0.7,0.475

### Placement (x,y rotation side)
1V8  10.03,20.32 0 bottom
3V0  0.64,27.94 0 bottom
C1  1.4,2.16 0 bottom
C2  0.76,7.56 270 top
C3  1.33,6.03 0 bottom
C4  1.4,9.84 180 bottom
C5  2.29,15.56 270 bottom
C6  3.24,15.56 270 bottom
C7  3.56,20 180 bottom
C8  1.46,20.45 0 bottom
C9  5.21,17.97 270 bottom
C10  4.25,17.97 270 bottom
C11  1.97,22.03 0 top
C12  1.97,23.43 0 top
C13  1.97,24.83 0 top
C14  3.43,34.1 180 bottom
C15  4.45,30.73 90 bottom
C16  3.43,33.15 180 bottom
C17  0.83,18.12 90 bottom
C18  3.49,30.73 90 bottom
C19  3.43,32.19 180 bottom
C20  2.67,28.32 90 bottom
C21  1.71,28.32 90 bottom
C22  1.4,33.15 180 bottom
C23  2.6,8.19 180 top
C24  3.43,21.84 90 top
C25  3.43,24.89 90 top
C26  1.71,11.49 270 top
C27  2.67,11.49 270 top
C28  3.17,34.35 0 top
C29  7.43,24.51 90 top
C30  7.43,28.7 270 top
C31  4.64,33.85 90 top
C32  4.57,11.18 270 top
C33  5.52,11.49 270 top
C34  9.08,21.15 90 bottom
C35  7.37,21.53 90 bottom
C36  3.94,35.62 180 top
C37  5.97,36.58 0 top
C38  7.18,15.56 270 bottom
C39  8.13,15.56 270 bottom
C40  6.73,17.97 270 bottom
C41  7.68,17.97 270 bottom
C42  8.38,36.07 90 top
C43  5.78,28 90 top
C44  5.78,30.42 90 top
C45  1.33,5.08 0 bottom
C46  10.03,33.34 90 bottom
C47  0.57,30.99 90 top
C48  9.27,2.16 180 bottom
C49  3.05,7.75 90 bottom
C50  8.38,10.73 0 bottom
C51  3.62,5.52 180 bottom
C52  0.83,39.43 90 top
C53  9.84,39.43 90 top
CS0  0.64,35.56 0 bottom
FD1  8.26,37.47 0 top
FD2  10.03,40.01 0 bottom
FD3  0.64,0.51 0 top
FD4  0.64,0.51 0 bottom
FLSH_CEN  10.03,17.78 0 bottom
FLSH_SCLK  10.03,5.08 0 bottom
FLSH_SI  10.03,7.62 0 bottom
FLSH_SO  10.03,10.16 0 bottom
FRAME1  45.72,-10.16 0 top  (outside the outline)
G16  1.14,33.85 180 top
GPIO0  0.64,3.81 0 bottom
IN  5.33,38.54 0 bottom
J25  4.32,38.48 270 top
K1  1.14,36.39 270 top
L1  8.38,9.78 0 bottom
L2  4.19,15.56 270 bottom
L3  1.78,22.61 90 bottom
L4  1.46,26.29 90 top
L5  1.65,30.16 270 bottom
L6  3.24,31.94 0 top
L7  3.43,26.67 90 top
L8  3.68,33.15 90 top
L9  0.76,11.49 90 top
L10  3.62,11.18 270 top
L11  7.87,21.97 180 top
L12  7.87,27.05 180 top
L13  7.56,20 0 bottom
L14  6.22,15.56 270 bottom
L15  8.64,17.97 270 bottom
LOGO1  19.05,50.8 0 top  (outside the outline)
LOGO2  8.13,39.12 90 top
LOGO3  6.48,32.89 0 bottom
OUT  5.33,2.1 180 top
Q2  7.81,11.24 270 top
R1  1.08,32.45 0 top
R2  2.6,9.21 180 top
R3  2.54,30.73 90 bottom
R4  0.84,14.54 270 bottom
R5  3.11,10.99 180 bottom
R6  3.94,23.37 180 top
R7  1.4,34.1 0 bottom
R8  3.11,11.94 0 bottom
R9  8.64,7.3 270 top
R11  0.76,9.53 270 top
R12  2.6,7.18 180 top
R14  5.78,25.53 270 top
R17  5.78,23.11 90 top
U1  5.84,7.68 270 top
U2  1.4,8.13 0 bottom
U3  5.21,16.76 90 top
U4  3.17,29.46 90 top
U5  6.48,34.42 90 top
U6  9.08,30.1 180 bottom
U7  8,12.57 0 bottom
U8  5.33,3.17 0 bottom
U$1  [#OUT#0]  5.33,4.89 0 top
U$2  [#IN#0]  5.33,35.75 0 bottom
U$4  5.33,26.1 0 bottom
U$5  [EZ_ARTIC_R20]  9.65,30.86 90 top
U$6  [EZ_ARTIC_R20]  5.33,24.45 0 bottom
U$8  9.65,24.51 90 top
VDD  10.03,25.4 0 bottom
X1  2.54,17.97 0 bottom

### Tracks (layer width: path | path; a pad name or v marks a point on that pad's centre or on a via)
1.8V  (via drill 0.2)
  Top 0.305: L4.2 0.82,26.79 0.37,26.34 0.37,16.13 | 0.37,16.13 0.37,12.39 L9.2 | v0.86,16.19 0.43,16.19 0.37,16.13
  Bottom 0.152: L13.2 7.69,19.37 8.51,19.37 8.75,19.61 9.32,19.61 1V8.1
  Bottom 0.254: U2.5 1.52,8.95 1.33,9.14 1.33,9.41 C4.1
  Bottom 0.305: L14.2 5.21,15.06 | 5.21,15.06 L2.2 4.19,14.86 3.21,13.88 1.53,13.88 1.52,13.89 | C4.1 0.9,12.9 1.52,13.53 1.52,13.89 | 1.52,13.89 1.52,15.94 1.31,16.16 0.9,16.16 v0.86,16.19 | L13.2 5.97,18.91 5.97,17.02 5.21,16.26 5.21,15.06
3.3V  (via drill 0.2)
  Top 0.254: v2.1,39.18 2.1,39.05 1.78,38.73 1.02,38.73 C52.1
  Top 0.305: OUT.15 2.08,1.45 v2.1,1.46 | v8.58,39.12 8.58,38.99 8.89,38.67 v9.21,38.67 | C53.1 9.58,38.67 v9.21,38.67 | R9.2 9.86,7.67 9.86,37.49 9.21,38.14 v9.21,38.67 | v8.64,1.52 8.58,1.47 OUT.2
  Top 0.406: v8,9.08 7.75,9.08 7.3,8.63 U1.6 6.99,8.63 6.54,9.08 v6.35,9.08 | v8.64,1.52 v8.64,2.79 v8.64,5.14 R9.2
  Route15 0.305: v2.1,1.46 2.1,0.7 2.35,0.45 8.38,0.45 8.64,0.7 v8.64,1.52 | v2.1,39.18 2.1,39.88 2.41,40.2 8.26,40.2 8.58,39.88 v8.58,39.12
  Bottom 0.254: IN.15 2.1,39.88 v2.1,39.18 | IN.2
  Bottom 0.305: v8.64,1.52 8.77,1.66 C48.1 8.77,2.66 v8.64,2.79 | v2.1,1.46 2.1,1.52 1.9,1.72 C1.1 | IN.2 v8.58,39.12 8.58,38.99 8.89,38.67 v9.21,38.67
  Bottom 0.406: v8,9.08 7.24,9.08 | 7.24,9.08 v6.35,9.08 | v8.64,5.14 8.38,5.4 8.38,6.54 7.24,7.68 7.24,9.08
  Bottom 0.61: v8.13,5.14 v8.64,5.14
ANTENNA
  Top 0.305: C37.1 4.65,36.58 J25.FEED
BOOT  (via drill 0.2)
  Top 0.152: U3.46 1.3,15.01 0.93,14.64 0.93,13.17 1.4,12.7 v2.07,12.7
  Route15 0.152: v2.07,12.7 2.07,10.32 3.44,8.95 3.44,5.32 4.32,4.45 5.71,4.45 6.48,3.68 v6.48,3.17
  Bottom 0.152: U8.3 6.87,2.85 6.51,3.21 v6.48,3.17 | R5.1 2.07,11.53 v2.07,12.7
CIPO  (via drill 0.2)
  Top 0.152: U3.5 4.48,13.34 4.48,12.83 v4.61,12.7 | OUT.6 6.58,1.4 5.4,2.59 v5.4,6.29
  Route15 0.152: v5.4,6.29 5.39,6.3 4.82,6.3 4.63,6.48 4.63,12.68 v4.61,12.7 4.61,12.74 5.2,13.32 5.2,34.63 6.03,35.47 6.03,38.29 6.35,38.61 v6.61,38.61
  Bottom 0.152: IN.6 6.61,39.87 v6.61,38.61
COPI  (via drill 0.2)
  Top 0.152: U3.4 3.98,13.34 3.98,12.82 v4.1,12.7 | OUT.5 7.08,1.3 5.71,2.67 5.71,5.35 6.09,5.72 v6.85,5.72
  Route15 0.152: v6.85,5.72 6.09,5.72 5.81,5.45 4.65,5.45 4.35,5.74 4.35,11.47 4.1,11.72 v4.1,12.7 4.1,12.75 4.85,13.5 4.85,34.75 5.75,35.65 5.75,38.47 6.34,39.05 6.92,39.05 v7.18,38.8
  Bottom 0.152: IN.5 7.18,39.8 v7.18,38.8
CS0  (via drill 0.2)
  Top 0.152: U3.2 2.96,12.83 v3.09,12.7
  Route15 0.127: 3.73,35.15 3.73,34.83 4.24,34.32 4.24,29.46 3.86,29.08 2.73,29.08 2.41,28.77 2.41,27.89 1.84,27.32 1.84,22.5 2.27,22.07 2.43,22.07 3.24,21.27 3.24,13.46 3.09,13.31 v3.09,12.7 | 3.73,35.15 4.24,35.66 4.24,37.81 6.04,39.61 7.68,39.61 8.01,39.28 8.01,38.95 7.16,38.1 v6.6,38.1 | v2.73,36.17 2.73,36.16 3.73,35.15
  Bottom 0.152: IN.7 6.08,38.57 6.55,38.1 v6.6,38.1 | v2.73,36.17 2.68,36.17 2.51,36.33 1.41,36.33 CS0.1
CS1  (via drill 0.2)
  Top 0.152: OUT.7 6.08,1.28 v5.91,1.46
  Route15 0.152: v6.93,37.71 7.5,37.71 8.89,36.32 8.89,34.83 9.47,34.25 9.47,19.89 8.83,19.24 8.83,17.32 9.14,17.01 9.79,17.01 10.03,16.76 10.03,4.83 6.67,1.46 v5.91,1.46
  Bottom 0.152: IN.8 5.58,38.57 6.44,37.71 6.77,37.71 v6.93,37.71
CS2  (via drill 0.2)
  Top 0.152: OUT.8 5.58,1.21 v5.33,1.46
  Route15 0.152: v7.31,37.32 8.61,36.01 8.61,34.71 9.19,34.13 9.19,20.75 8.45,20 8.45,17.27 8.99,16.73 9.6,16.73 9.75,16.57 9.75,4.94 6.66,1.85 5.72,1.85 v5.33,1.46
  Bottom 0.152: IN.9 5.08,38.67 6.44,37.32 v7.31,37.32
FLASH_VCC
  Bottom 0.152: U7.8 7.1,13.32 7.15,13.37 | U7.3 9.08,12.32 8.77,12.62 | 8.77,10.84 C50.1 8.88,11.12 8.26,11.75 8.26,12.32 8.56,12.62 8.77,12.62 | 8.77,12.62 8.77,13.39 8.32,13.84 7.62,13.84 7.23,13.45 7.15,13.37 | U7.7 7.15,12.83 7.15,13.37
  Bottom 0.305: C50.1 L1.1
FLSH_CEN  (via drill 0.2)
  Top 0.254: U3.15 9.24,15.01 v9.34,15.11
  Bottom 0.152: U7.1 9.27,13.32 8.83,13.76 8.83,14.61 v9.34,15.11 10.16,15.11 10.41,15.37 10.41,17.4 FLSH_CEN.1
FLSH_SCLK  (via drill 0.2)
  Top 0.152: v8.38,13.02 8.38,13.21 8.23,13.36 U3.12
  Route15 0.152: v9.27,5.14 7.11,7.3 7.11,12.38 7.75,13.02 v8.38,13.02
  Bottom 0.152: U7.6 7.24,12.32 7.43,12.51 7.43,13.26 7.74,13.56 8.14,13.56 8.37,13.34 8.37,13.03 v8.38,13.02 | FLSH_SCLK.1 9.34,5.08 v9.27,5.14
FLSH_SI  (via drill 0.2)
  Top 0.254: U3.13 9.29,14.01 v9.34,13.97
  Route15 0.152: v9.34,13.97 9.34,13.27 7.87,11.81 v7.62,11.81 7.62,10.82 v9.36,9.08
  Bottom 0.152: U7.5 7.61,11.82 v7.62,11.81 | FLSH_SI.1 10.03,8.41 v9.36,9.08
FLSH_SO  (via drill 0.2)
  Top 0.254: U3.14 9.31,14.51 v9.34,14.54
  Bottom 0.152: 10.03,12.83 10.03,13.84 v9.34,14.54 | 10.03,12.83 FLSH_SO.1 | U7.2 10.03,12.82 10.03,12.83
G8  (via drill 0.2)
  Top 0.152: K1.1 1.54,38.22 v1.52,38.24
  Route15 0.152: v4.45,2.16 4.06,1.78 4.06,1.33 4.33,1.07 6.67,1.07 7.89,2.29 9.02,2.29 9.27,2.54 9.27,3.67 10.31,4.71 10.31,35.21 v9.32,36.2
  Bottom 0.152: v1.52,38.24 1.52,37.34 2.11,36.76 2.69,36.76 3.25,36.2 v9.32,36.2 | v4.45,2.16 4.4,2.2 U8.5
GND  (via drill 0.2)
  Top 0.152: U3.30 5.46,21.4 5.14,21.72 4.95,21.72 | v4.38,21.72 4.95,21.72 | U3.31 4.96,21.71 4.95,21.72 | U3.29 5.94,20.18 5.94,21.05 6.22,21.34 v6.6,21.34 | v0.89,29.21 0.7,29.21 0.45,29.46 0.45,30.36 C47.1 | K1.2 0.74,38.08 v0.89,38.23
  Top 0.203: U4.2 2.92,27.5 2.54,27.11 v2.54,26.99
  Top 0.254: v6.6,21.34 6.6,21.27 6.96,20.92 U3.27 6.96,19.08 6.99,19.05 | 8.13,20.83 7.96,20.66 U3.25 7.96,19.39 7.62,19.05 6.99,19.05 | v4.46,19.19 U3.32 4.46,21.64 v4.38,21.72 | v4.46,19.19 v4.45,19.18 | U3.39 2.61,18.51 2.86,18.76 v2.86,19.18 | 6.99,19.05 5.97,19.05 | 5.97,19.05 5.46,19.05 | 5.46,19.05 4.95,19.05 | 4.95,19.05 4.6,19.05 v4.46,19.19 | U3.31 4.96,19.05 4.95,19.05 | U3.30 5.46,19.05 | U3.29 5.96,19.06 5.97,19.05
  Top 0.305: v2.1,38.42 2.26,38.58 J25.2 3.17,38.35 3.17,37.34 v3.37,37.15 | v5.33,37.27 5.52,37.27 5.69,37.44 J25.1 | C32.2 5.21,10.68 C33.2 6.04,10.99 v6.29,11.24 | v2.73,10.29 2.67,10.35 C27.2 C26.2 | C28.1 2.67,34.49 2.79,34.61 2.79,34.99 | 2.79,34.99 2.79,35.37 v2.67,35.5 3.31,35.5 C36.2 | v4.13,34.99 2.79,34.99
  Top 0.406: 8.13,20.83 8.31,21.01 L11.P$1 L12.P$1 8.31,27.67 v8.32,27.69 8.32,33.08 v7.75,33.66 | R6.1 | v6.6,21.34 v6.6,21.97 v6.6,23.24 v6.6,24.51 v6.6,25.78 v6.6,27.05 v6.6,28.32 v6.6,29.59 v6.6,31.11 | C44.2 6.41,30.92 v6.6,31.11 | v5.52,8 5.21,7.68 | U1.2 5.21,7.68 | v5.52,7.37 5.21,7.68 | U5.2 v6.48,32.38 6.6,32.26 v6.6,31.11
  Top 0.61: v4.38,21.72 v4.38,22.61 v4.38,24.51 v4.38,25.78 v4.38,27.05 | 2.54,21.45 v2.54,22.73 v2.54,24.13 v2.54,25.53 v2.54,26.99
  Bottom 0.152: U7.4 8.88,11.82 v8.7,12 | v2.67,35.5 1.91,35.5 0.9,34.49 R7.2 C22.1 0.9,32.25 v1.46,31.69 | X1.2 1.44,17.09 0.26,17.09 | C3.2 0.26,6.61 0.26,14.05 | 0.26,17.09 0.26,20.26 0.44,20.45 C8.2 1.02,20.45 1.93,19.54 2.27,19.54 2.63,19.18 v2.86,19.18 | 0.26,17.09 0.26,14.05 | R4.2 0.26,14.04 0.26,14.05
  Bottom 0.254: X1.1 3.24,17.15 v2.86,16.76
  Bottom 0.305: C50.2 6.79,10.73 v6.29,11.24
  Bottom 0.406: v1.46,7.87 1.46,7.37 U2.2 1.46,7.24 v1.46,6.67
  other vias: 8.32,22.61 8.32,21.34 8.32,25.15 8.32,26.42 4.45,16.76 2.79,14.35 4.45,14.35 5.97,14.35 7.62,14.35 8.32,23.88 2.54,21.34 2.79,29.46 3.56,29.46 5.84,31.69 9.33,36.77 6.48,34.16 8.32,30.1 8.32,33.02 8,1.65 9.84,1.52 4.89,5.84 8.32,38.48 7.62,16.76 5.33,2.1 1.84,3.11 7.43,5.71 7.3,19.18 7.37,36.64 5.93,26.76 1.33,4.38
  cutout Route2 (isolate 0.305): 6.86,33.78 8,33.78 8,21.08 7.75,20.83 7.75,19.68 7.11,19.68 7.11,20.95 6.86,21.21
  pour Top (isolate 0.152, rank 3): 0,40.64 10.67,40.64 10.67,0 0,0
  pour Route2 (isolate 0.152, rank 2): 0,40.64 10.67,40.64 10.67,0 0,0
  pour Route15 (isolate 0.152, rank 2): 0,40.64 10.67,40.64 10.67,0 0,0
  pour Bottom (isolate 0.152, rank 2): 0,40.64 10.67,40.64 10.67,0 0,0
  pour Top (isolate 0.102): 2.29,28.32 4.7,28.32 4.7,19.43 2.29,19.43
  pour Top (isolate 0.102): 6.41,33.78 8.51,33.78 8.51,19.43 6.41,19.43
  pour Top (isolate 0.102): 2.92,34.73 6.41,34.73 6.41,30.29 2.92,30.29
  pour Top (isolate 0.102): 2.35,39.75 6.92,39.75 6.92,34.73 2.35,34.73
GPIO0  (via drill 0.2)
  Top 0.152: R12.1 3.1,7.17 2.54,6.6 v2.54,6.35 2.54,4.7 1.76,3.92 v1.57,3.92
  Top 0.305: R12.1 3.55,6.73 U1.3
  Route15 0.127: v3.38,36.62 1.82,36.62 1.57,36.37 1.57,33.33 2.68,32.23 2.68,30.98 2.12,30.43 2.12,28.04 1.57,27.5 1.57,22.37 2.1,21.84 2.1,20.82 2.48,20.45 2.48,14.79 1.44,13.75 1.44,10.18 2.54,9.08 v2.54,6.35
  Bottom 0.152: v3.38,36.62 3.7,36.62 4.58,37.5 IN.10 | v1.57,3.92 1.45,3.8 0.65,3.8 GPIO0.1
GPIO1  (via drill 0.2)
  Top 0.152: OUT.10 4.58,1.45 v4.57,1.46
  Route15 0.127: v2.73,37.15 2.46,36.88 1.48,36.88 1.29,36.7 1.29,32.49 2.23,31.55 2.23,31 1.84,30.61 1.84,28.2 1.29,27.65 1.29,22.25 1.82,21.73 1.82,20.71 2.22,20.31 2.22,14.93 1.18,13.89 1.18,10.04 1.85,9.37 1.85,4.18 2.15,3.88 4.61,3.88 4.84,3.65 4.84,1.73 v4.57,1.46
  Bottom 0.152: IN.11 4.08,38.5 v2.73,37.15
INT1  (via drill 0.2)
  Top 0.152: U3.47 1.31,14.51 1.21,14.41 1.21,13.59 1.59,13.21 v1.91,13.21
  Route15 0.127: v1.91,13.21 1.91,13.15 1.69,12.93 1.69,10.29 3.17,8.8 3.17,5.21 4.21,4.18 5.61,4.18 6.1,3.69 6.1,3.02 6.32,2.8 6.63,2.8 6.86,3.02 6.86,4 v6.54,4.32
  Bottom 0.152: U8.2 6.85,3.5 6.54,3.81 v6.54,4.32
N$1
  Top 0.305: U1.5 7.21,7.75 8.23,7.75 R9.1 8.64,10.96 Q2.3
N$2
  Top 0.152: R2.1 3.68,9.21 4,9.53 7.37,9.53 7.68,9.84 7.68,10.73 6.81,11.6 Q2.1
N$3  (via drill 0.2)
  Top 0.203: R2.2 2.1,9.34 2.6,9.84 v3.23,9.84
  Top 0.305: v5.78,6.79 5.84,6.73 U1.4 | R11.1 0.82,9.97 1.34,9.97 R2.2
  Bottom 0.203: v5.78,6.79 5.46,6.79 4.7,7.56 4.7,9.46 4.32,9.84 v3.23,9.84
N$4  (via drill 0.2)
  Top 0.254: U3.24 8.61,19.91 8.7,20 v9.02,20
  Bottom 0.305: C35.1 7.62,20.77 7.62,20.57 8.06,20.13 L13.1 v9.02,20 9.02,20.58 C34.1
N$5  (via drill 0.2)
  Top 0.254: U3.23 9.08,19.01 9.09,19.02 9.18,19.02 v9.34,19.18
  Bottom 0.305: L15.1 8.64,18.99 8.83,19.18 v9.34,19.18
  Bottom 0.406: C40.1 C41.1 L15.1
N$6
  Top 0.305: C2.1 R11.2
  Top 0.406: 0.75,9.02 R11.2
N$7
  Top 0.305: U1.1 4.48,8.57 3.67,8.57 3.29,8.19 C23.1
N$8
  Top 0.152: U3.6 5.01,13.31 5.01,12.48 4.81,12.28 2.96,12.28 C27.1 | L9.1 0.76,11.02 1.71,11.97 C26.1
  Top 0.254: C26.1 C27.1
N$9  (via drill 0.2)
  Top 0.152: v5.97,12.7 5.97,12.76 6.02,12.81 6.36,12.81 6.46,12.91 U3.9
  Top 0.254: L10.1 C32.1 5.21,11.68 C33.1 5.97,12.44 v5.97,12.7
  Bottom 0.152: v5.97,12.7 5.21,11.94 R8.1 R5.2
N$10  (via drill 0.2)
  Top 0.254: U3.35 2.96,20.67 2.79,20.83 v2.67,20.83 2.35,20.83 1.66,21.52 1.66,21.84 C11.1 C12.1 C13.1 L4.1 | U3.28 6.46,20.77 v6.33,20.89 | U3.33 3.96,20.77 v4.01,20.83
  Bottom 0.254: v6.33,20.89 6.27,20.83 v4.01,20.83 v2.67,20.83
N$11  (via drill 0.2)
  Top 0.152: U3.36 2.2,20.16 1.43,20.93 v1.43,21.12
  Bottom 0.254: L3.1 1.78,21.46 v1.43,21.12 1.43,21.1 1.96,20.57 C8.1 1.98,20.45 2.42,20 C7.1
N$12  (via drill 0.2)
  Top 0.127: U3.41 1.33,17.51 1.25,17.42 1.25,16.03 v0.9,15.68
  Bottom 0.152: v0.9,15.68 0.9,15.11 R4.1
N$13  (via drill 0.2)
  Top 0.152: U3.40 1.25,18.01 0.85,17.62 v0.85,16.7
  Bottom 0.152: v0.85,16.7 1.64,16.7 C5.1 C6.1 L2.1
N$14  (via drill 0.2)
  Top 0.152: v1.14,19.77 1.14,19.67 1.3,19.51 U3.37
  Bottom 0.152: v1.14,19.77 1.65,19.26 2.16,19.26 2.63,18.79 2.9,18.79 X1.4 4.23,18.45 C10.1 C9.1
N$15
  Bottom 0.152: C17.1 0.91,17.62 1.74,18.45 X1.3
N$16  (via drill 0.2)
  Top 0.152: U3.38 1.15,19.01 0.85,19.31 v0.85,19.35
  Bottom 0.152: v0.85,19.35 0.83,19.33 C17.2
N$17
  Top 0.254: U3.34 3.46,21.32 C24.1
N$18
  Top 0.254: 3.43,23.36 R6.2 | C25.1
  Top 0.305: C24.2 3.43,23.36 | R6.2 C25.1
N$19  (via drill 0.2)
  Top 0.254: v0.89,29.72 U4.14
  Bottom 0.254: L5.P$2 0.9,29.73 v0.89,29.72
N$20
  Bottom 0.254: C15.1 C18.1 R3.1 2.18,30.59 L5.P$1
N$21
  Top 0.254: C29.P$1 7.44,24.1 7.43,24.09 7.44,24.08 7.44,24.07 | 7.46,21.96 L11.P$2 arc-45 L11.P$2 | U3.26 7.46,21.13 7.44,21.14
  Top 0.508: 7.44,21.14 L11.P$2 | L11.P$2 7.44,24.08
N$24
  Top 0.305: C25.2 L7.P$1
N$25
  Top 0.254: L7.P$2 U4.3
N$26
  Top 0.254: U4.10 3.68,30.91 U4.9
  Top 0.305: 3.68,31.93 L6.P$2 | 3.68,31.93 3.68,30.91 | L8.P$1 3.68,31.93
N$28
  Top 0.305: C31.1 5.8,33.35 U5.1
N$29
  Top 0.508: C30.1 7.43,33.01 U5.3
N$30
  Top 0.305: U5.5 6.48,36.57 C37.2
N$31  (via drill 0.2)
  Top 0.254: U3.20 9.22,17.51 v9.34,17.4
  Bottom 0.152: C39.1 8.64,15.55 9.64,15.55 9.78,15.68 9.78,16.95 v9.34,17.4
  Bottom 0.254: C39.1 C38.1 L14.1
PA_PD  (via drill 0.2)
  Top 0.152: U3.7 5.46,12.75 v5.41,12.7 | R17.1 5.91,22.49 v5.91,21.84
  Top 0.254: U3.7
  Route15 0.152: v5.41,12.7 5.52,12.82 5.52,21.46 v5.91,21.84
PD  (via drill 0.2)
  Top 0.152: C44.1 5.84,29.85 v5.84,29.21 5.84,28.57 C43.2 | R17.2 5.84,23.68 v5.84,24.32 5.84,24.96 R14.2 | U4.6 v5.84,29.21
  Top 0.254: U4.6 | 5.73,28.45 C43.2 | v5.84,29.21
  Route15 0.152: v5.84,29.21 5.5,28.87 5.5,24.66 v5.84,24.32
PROC_PWR_EN  (via drill 0.2)
  Top 0.305: OUT.1 9.08,1.08 9.34,1.33 9.34,3.68 10.29,4.64 v10.29,38.23 v9.78,38.23
  Bottom 0.305: v10.29,38.23 10.03,38.23 | 10.03,38.23 v9.78,38.23 | IN.1 9.08,39.3 9.21,39.18 9.78,39.18 10.03,38.92 10.03,38.23
RESETB  (via drill 0.2)
  Top 0.152: U3.1 2.46,12.82 v2.58,12.7
  Route15 0.127: v2.58,12.7 2.58,12.41 3.75,11.24 3.75,5.41 4.38,4.77 7.04,4.77 7.18,4.64 v7.56,4.64
  Bottom 0.152: U8.1 7.58,4.61 v7.56,4.64 | v2.58,12.7 2.58,11.97 R8.2
RF_RX
  Top 0.508: C29.P$2 7.44,24.92 L12.P$2 7.44,28.19 C30.2
RF_TX
  Top 0.305: L8.P$2 C28.2 3.68,34.35 C31.2
RFG8  (via drill 0.2)
  Top 0.152: U4.12 2.42,31.17 2.29,31.3 v1.84,31.3 | K1.4 1.54,35.16 1.65,35.05 v2.29,35.05
  Bottom 0.152: v2.29,35.05 2.15,35.05 1.9,34.8 R7.1 C22.2 1.89,31.36 v1.84,31.3
RFG16
  Top 0.152: U4.13 1.73,30.41 0.64,31.49 C47.2 R1.1 0.58,32.84 0.7,32.96 1.52,32.96 1.66,33.1 G16.1
RXSW  (via drill 0.2)
  Top 0.152: v9.35,34.92 9.17,34.75 5.96,34.75 5.83,34.88 U5.6
  Top 0.203: U3.22 9.27,18.51 v9.34,18.58
  Top 0.305: C36.1 5.72,35.62 U5.6
  Route15 0.152: v9.34,18.58 9.75,18.99 9.75,34.52 v9.35,34.92
SCL  (via drill 0.2)
  Top 0.152: OUT.13 3.08,1.94 v4,2.86
  Route15 0.127: v2.16,37.85 1.18,37.85 0.74,37.4 0.74,30.43 1.28,29.88 1.28,28.54 0.74,28 0.74,20.82 1.71,19.84 1.71,15.22 0.67,14.18 0.67,3.26 1.21,2.73 3.87,2.73 v4,2.86
  Bottom 0.152: IN.13 3.08,38.77 v2.16,37.85 | v4,2.86 v3.99,2.85 U8.6
SCLK  (via drill 0.2)
  Top 0.152: U3.3 3.48,13.34 3.48,12.81 v3.59,12.7 | OUT.4 7.58,1.31 6.06,2.83 6.06,5.04 6.18,5.17 v6.44,5.17
  Route15 0.127: v7.62,39.12 7.4,39.33 6.16,39.33 4.52,37.69 4.52,29.54 4.52,29.38 3.96,28.83 2.84,28.83 2.67,28.66 2.67,27.75 2.35,27.43 2.11,27.19 2.11,22.61 2.38,22.34 2.54,22.34 3.5,21.38 3.5,13.36 3.59,13.27 v3.59,12.7
  Route15 0.152: v3.59,12.7 3.59,11.84 4.08,11.36 4.08,5.51 4.42,5.17 v6.44,5.17
  Bottom 0.152: IN.4 7.62,39.86 v7.62,39.12
SDA  (via drill 0.2)
  Top 0.152: OUT.12 3.58,1.89 4.45,2.75 v4.45,3.49
  Route15 0.127: v2.16,37.27 1.21,37.27 1.02,37.08 1.02,30.54 1.56,30 1.56,28.37 1.02,27.83 1.02,20.96 1.97,20.01 1.97,15.07 0.93,14.04 0.93,3.83 1.27,3.49 v4.45,3.49
  Bottom 0.152: IN.12 3.58,38.7 v2.16,37.27 | v4.45,3.49 3.09,3.49 U8.7
TXSW  (via drill 0.2)
  Top 0.203: U3.21 9.29,18.01 v9.34,17.97
  Top 0.305: U5.4 8.33,35.52 C42.1 v9.33,35.57 v9.34,35.56
  Route15 0.152: v9.34,17.97 10.03,18.67 10.03,34.86 v9.34,35.56
V_USB  (via drill 0.2)
  Top 0.305: OUT.16 1.58,1.37 v1.49,1.46
  Route15 0.305: v1.59,39.18 0.64,39.18 0.38,38.92 0.38,18.93 1.37,17.94 1.37,15.38 0.33,14.34 0.33,2.62 v1.49,1.46
  Bottom 0.254: IN.16 v1.58,39.18 v1.59,39.18
VDD  (via drill 0.2)
  Top 0.254: L6.P$1 2.68,32.07 v2.29,32.07
  Top 0.406: Q2.2 6.18,10.29 5.86,9.97 v5.84,9.97 v5.21,9.97 3.88,9.97 3.62,10.23 L10.2
  Route15 0.254: v9.36,16.14 6.67,16.14
  Route15 0.305: v8.42,34.35 v8.75,34.02 8.83,33.94 8.83,21.02 7.68,19.88 7.24,19.88 6.67,19.3 6.67,16.14 6.67,12.57 5.52,11.43 5.52,9.97
  Route15 0.406: v5.21,9.97 5.52,9.97 v5.84,9.97
  Bottom 0.203: U2.1 2.05,8.11 1.84,8.32 0.95,8.32 0.75,8.11 U2.3
  Bottom 0.254: C19.1 2.41,32.19 v2.29,32.07 2.29,31.49 R3.2
  Bottom 0.406: C19.1 C16.1 C14.1 2.93,34.62 3.87,35.56 7.21,35.56 v8.75,34.02 | L1.2 6.99,9.78 6.8,9.97 v5.84,9.97 5.52,9.97 | 5.52,9.97 v5.21,9.97 | C49.1 2.1,7.25 U2.1 2.02,7.28 2.02,6.22 C3.1 C45.1 2.87,5.08 3.12,5.33 C51.1 3.08,5.49 U8.8 4.28,4.15 6.35,6.22 6.35,7.94 5.52,8.76 5.52,9.97 | v8.75,34.02 v8.42,34.35 | L3.2 2.1,23.43 5.84,23.43 6.29,23.88 7.11,23.88 7.81,24.57 9.21,24.57 VDD.1 9.14,26.29 9.14,29.53 10.03,30.41 U6.3 C46.1 9.18,32.84 9.18,32.97 | U6.1 8.13,31.92 9.18,32.97 | 9.18,32.97 9.18,33.59 v8.75,34.02 | v9.36,16.14 8.64,16.87 L15.2
VREF1  (via drill 0.2)
  Top 0.152: G16.2 0.74,33.97 K1.3 0.74,36.24 0.89,36.39 1.91,36.39 2.22,36.07 v2.22,35.94 | v0.89,28.7 v0.9,28.71 U4.16
  Bottom 0.152: v0.89,28.7 0.44,28.7 0.32,28.83 0.32,34.67 0.51,34.86 0.88,34.86 1.95,35.94 v2.22,35.94 | C21.2 1.6,28.7 v0.89,28.7 | 3V0.1 0.64,28.07 0.89,28.32 v0.89,28.7
  Bottom 0.406: U6.5 8.13,28.45 7.43,27.75 5.02,27.75 3.94,28.82 C20.2 C21.2

### Text on the board
Bottom: X01
Measures: Dimensions in Inches
tDocu: JLCPCB JLC7628 4-Layer 0.8mm Impedance Control / 4-Layer Board / 0.8mm Thickness / 1oz Copper (Outer layers) / ENIG Finish | Paul Clark